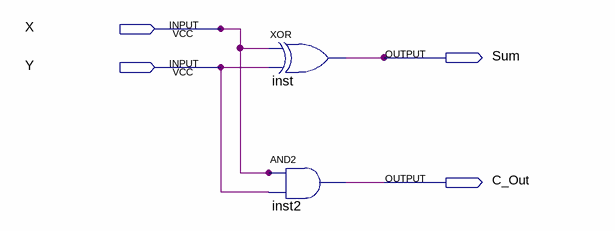
[diagram p0: schematic sheet]
// Quartus schematic Half_Adder.bdf as structural Verilog: 2 symbols, 4 pins
module Half_Adder (
  input  X,
  input  Y,
  output Sum,
  output C_Out
);

  xor inst (Sum, X, Y);
  and inst2 (C_Out, X, Y);
endmodule
